# EAGLE schematic stm32f103c8t6 (EAGLE 9.6.2)
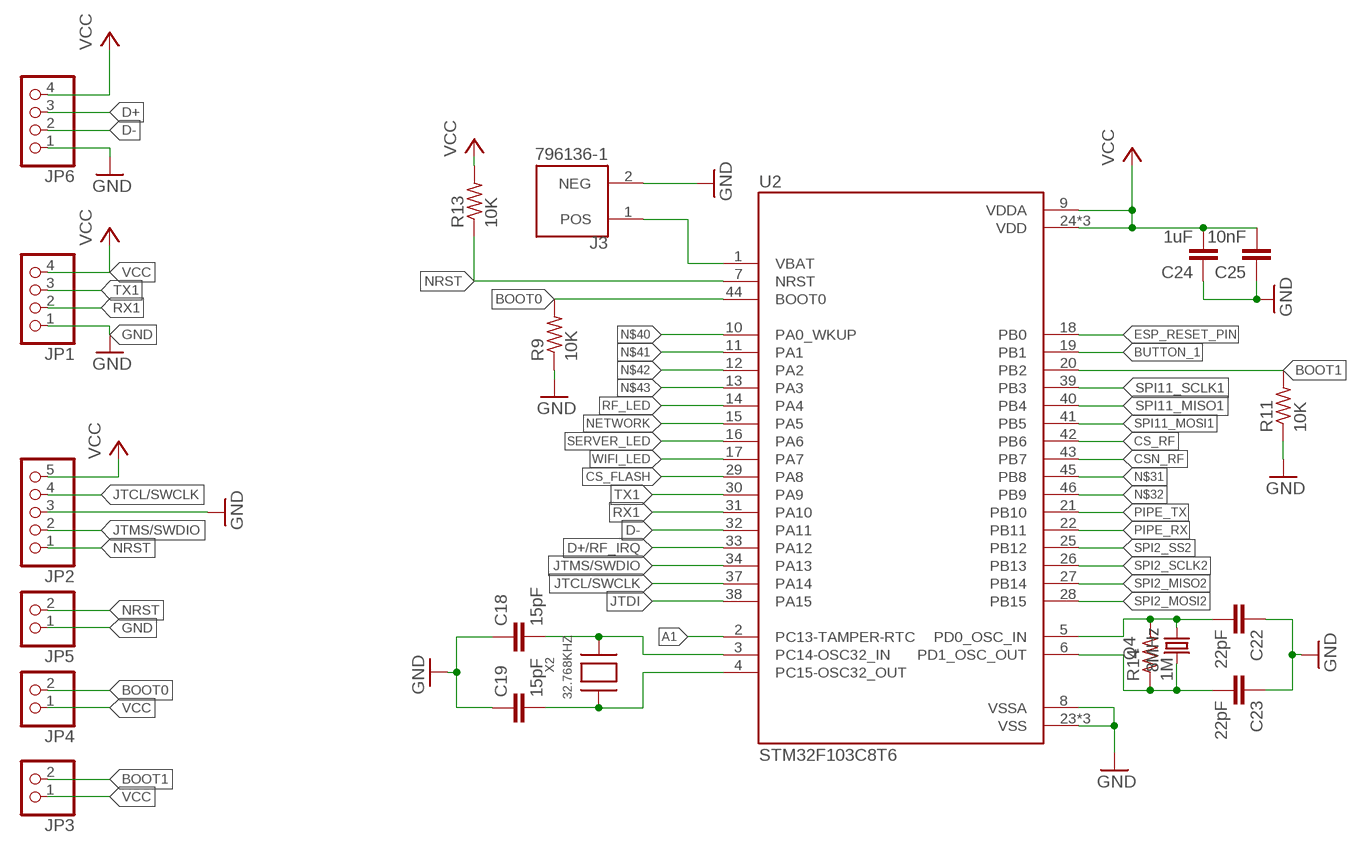
[diagram p0: schematic, sheet 1]

## Parts
C18  15pF  C-EUC0603  [C0603]
C19  15pF  C-EUC0603  [C0603]
C22  22pF  C-EUC0603  [C0603]
C23  22pF  C-EUC0603  [C0603]
C24  1uF  C-EUC0603  [C0603]
C25  10nF  C-EUC0603  [C0603]
J3  796136-1  [TE_796136-1]
JP1  PINHD-1X4  [1X04]
JP2  PINHD-1X5  [1X05]
JP3  PINHD-1X2  [1X02]
JP4  PINHD-1X2  [1X02]
JP5  PINHD-1X2  [1X02]
JP6  PINHD-1X4  [1X04]
Q4  8MHz  KX-7  [3.2X2.5_KX-7]
R9  10K  R-US_R0603  [R0603]
R11  10K  R-US_R0603  [R0603]
R13  10K  R-US_R0603  [R0603]
R14  1M  R-US_R0603  [R0603]
U2  STM32F103C8T6  [QFP50P900X900X160-48N]
X2  32.768KHZ  XTAL-3.2X1.5  [XTAL3215]

## Nets
A1: U2.2(PC13-TAMPER-RTC)
BOOT0: JP4.2 R9.2 U2.44(BOOT0)
BOOT1: JP3.2 R11.2 U2.20(PB2)
BUTTON_1: U2.19(PB1)
CS_FLASH: U2.29(PA8)
CS_RF: U2.42(PB6)
CSN_RF: U2.43(PB7)
D+: JP6.3
D+/RF_IRQ: U2.33(PA12)
D-: JP6.2 U2.32(PA11)
ESP_RESET_PIN: U2.18(PB0)
GND: C18.1 C19.1 C22.1 C23.1 C24.1 C25.1 J3.2(NEG) JP1.1 JP2.3 JP5.1 JP6.1 R9.1 R11.1 U2.8(VSSA) U2.23(VSS) U2.35(VSS) U2.47(VSS)
JTCL/SWCLK: JP2.4 U2.37(PA14)
JTDI: U2.38(PA15)
JTMS/SWDIO: JP2.2 U2.34(PA13)
N$9: C18.2 U2.3(PC14-OSC32_IN) X2.P$2
N$10: C19.2 U2.4(PC15-OSC32_OUT) X2.P$1
N$30: C23.2 Q4.3 R14.1 U2.6(PD1_OSC_OUT)
N$31: C22.2 Q4.1 R14.2 U2.5(PD0_OSC_IN) U2.45(PB8)
N$32: J3.1(POS) U2.1(VBAT) U2.46(PB9)
N$40: U2.10(PA0_WKUP)
N$41: U2.11(PA1)
N$42: U2.12(PA2)
N$43: U2.13(PA3)
NETWORK: U2.15(PA5)
NRST: JP2.1 JP5.2 R13.1 U2.7(NRST)
PIPE_RX: U2.22(PB11)
PIPE_TX: U2.21(PB10)
RF_LED: U2.14(PA4)
RX1: JP1.2 U2.31(PA10)
SERVER_LED: U2.16(PA6)
SPI2_MISO2: U2.27(PB14)
SPI2_MOSI2: U2.28(PB15)
SPI2_SCLK2: U2.26(PB13)
SPI2_SS2: U2.25(PB12)
SPI11_MISO1: U2.40(PB4)
SPI11_MOSI1: U2.41(PB5)
SPI11_SCLK1: U2.39(PB3)
TX1: JP1.3 U2.30(PA9)
VCC: C24.2 C25.2 JP1.4 JP2.5 JP3.1 JP4.1 JP6.4 R13.2 U2.9(VDDA) U2.24(VDD) U2.36(VDD) U2.48(VDD)
WIFI_LED: U2.17(PA7)

## Library data of the parts
C18 C19 C22-C25 = rcl:C-EU: CAPACITOR, European symbol; SPICEPREFIX: C
J3 = 796136-1:796136-1: BATTERY HOLDER COIN 20MM SMD Check prices <https://pricing.snapeda.com/parts/796136-1/TE%20Connectivity/view-part?ref=eda>; AVAILABILITY: Good; COMMENT: 796136-1; DESCRIPTION: BATTERY HOLDER; No. of Batteries:1; Terminal Type:Surface Mount; For Use With:CR2032 Batteries; Accessory Type:Battery Holder; Battery Size Code:2032; EU_ROHS_COMPLIANCE: Compliant; MF: TE Connectivity; MP: 796136-1; NUMBER_OF_POSITIONS: 2; PACKAGE: CR 2032 Battery Holder TE Connectivity; PRICE: None; PURCHASE-URL: https://pricing.snapeda.com/search/part/796136-1/?ref=eda
JP1 JP6 = pinhead:PINHD-1X4: PIN HEADER
JP2 = pinhead:PINHD-1X5: PIN HEADER
JP3-JP5 = pinhead:PINHD-1X2: PIN HEADER
Q4 = crystal-geyer_V1_0:KX: Quartz Crystals (MHz) SMD: KX - Serie Model Size l/w/h [mm] Frequency Range Frequency Stability Temp. Range [°C] Load Capacitance AECQ 200 availabel Datasheet KX-4 KX-5 KX-6 KX-7 KX-9A KX-9B KX-12A KX-12B KX-13 KX-20 KX-K KX-KS 1.6/1.2/0.3 2.0/1.6/0.45 2.5/2.0/0.55 3.2/2.5/0.8 5.0/3.2/1.0 5.0/3.2/1.1 6.0/3.5/1.1 6.0/3.5/1.0 7.0/5.0 /1.3 11.6/5.5/1.6 12.3/4.5/4.2 12.3/4.5/3.2 24.0 ~ 80.0 MHz 16.0 ~ 80.0 MHz 12.0 ~ 80.0 MHz 8.0 ~ 60.0 MHz 7,68 ~ 300,0 MHz 8,0 ~ 50,0 MHz 8,0 ~ 150,0 MHz 8,0 ~ 50,0 MHz 6,0 ~ 160,0 MHz 3,579 ~ 25,0 MHz 3,579 ~ 70,0 MHz 3,579 ~ 70,0 MHz ±10 … ±50ppm ±10 … ±50ppm ±10 … ±50ppm ±10 … ±50ppm ±10 … ±50ppm ±10 … ±50ppm ±10 … ±50ppm ±10 … ±50ppm ±10 … ±50ppm ±50ppm ±10 … ±50ppm ±10 … ±50ppm (*) -40°C …+85°C (*) -40°C …+125°C (*) -40°C …+125°C (*) -40°C …+125°C (*) -40°C …+105°C (*) -40°C …+105°C (*) -40°C …+125°C (*) -40°C …+105°C (*) -40°C …+105°C (*) -40°C …+105°C (*) -40°C …+85°C (*) -40°C …+85°C 8, 8…16 8, 8…16 10, 8…16 12, 7…20 16, 10…20 16, 10…20 16, 10…20 16, 12…20 16, 12…20 16, 12…20 16, 12…30 16, 12…30 - yes yes yes - - - - - - - - KX-4.pdf <http://www.geyer-electronic.de/uploads/tx_userartikelfrequenz/GEYER-KX-4.pdf> KX-5.pdf <http://www.geyer-electronic.de/uploads/tx_userartikelfrequenz/GEYER-KX-5.pdf> KX-6.pdf <http://www.geyer-electronic.de/uploads/tx_userartikelfrequenz/GEYER-KX-6.pdf> KX-7.pdf <http://www.geyer-electronic.de/uploads/tx_userartikelfrequenz/GEYER-KX-7.pdf> KX-9A.pdf <http://www.geyer-electronic.de/uploads/tx_userartikelfrequenz/GEYER-KX-9A.pdf> KX-9B.pdf <http://www.geyer-electronic.de/uploads/tx_userartikelfrequenz/GEYER-KX-9B.pdf> KX-12A.pdf <http://www.geyer-electronic.de/uploads/tx_userartikelfrequenz/GEYER-KX-12A.pdf> KX-12B.pdf <http://www.geyer-electronic.de/uploads/tx_userartikelfrequenz/GEYER-KX-12B.pdf> KX-13.pdf <http://www.geyer-electronic.de/uploads/tx_userartikelfrequenz/GEYER-KX-13.pdf> KX-20.pdf <http://www.geyer-electronic.de/uploads/tx_userartikelfrequenz/GEYER-KX-20.pdf> KX-K.pdf <http://www.geyer-electronic.de/uploads/tx_userartikelfrequenz/GEYER-KX-K.pdf> KX-KS.pdf <http://www.geyer-electronic.de/uploads/tx_userartikelfrequenz/GEYER-KX-KS.pdf> <http://www.geyer-electronic.de/fileadmin/template/img/logo-geyer-electronic.png> Details see: http://www.geyer-electronic.de/Frequenz-Produkte.9.0.html Created 2016-06-07, Hans Locher 2016 (C) Geyer Quartz Technology KX4,KX5,KX6,KX7,KX9A,KX9B,KX12A,KX12B,KX13,KX20,KXK,KXKS;1612;2016;2520;3225;5032;6035;7050;11655;12345;1,6x1,2;2,0x1,6;2,5x2,0;3,2x2,5;5,0x3,2;6,0x3,5;7,0x5,0;11,6x5,5;12,3x4,5;12,3x4,5;1.6x1.2;2.0x1.6;2.5x2.0;3.2x2.5;5.0x3.2;6.0x3.5;7.0x5.0;11.6x5.5;12.3x4.5;12.3x4.5;
R9 R11 R13 R14 = rcl:R-US_: RESISTOR, American symbol; SPICEPREFIX: R
U2 = STM32F103C8T6:STM32F103C8T6: Mainstream Performance line, ARM Cortex-M3 MCU with 64 Kbytes Flash, 72 MHz CPU, motor control, USB and CAN Check prices <https://pricing.snapeda.com/parts/STM32F103C8T6/STMicroelectronics/view-part?ref=eda>; AVAILABILITY: Warning; DESCRIPTION: ARM® Cortex®-M3 STM32F1 Microcontroller IC 32-Bit 72MHz 64KB (64K x 8) FLASH 48-LQFP (7x7); MF: STMicroelectronics; MP: STM32F103C8T6; PACKAGE: LQFP-48 STMicroelectronics; PRICE: None; PURCHASE-URL: https://pricing.snapeda.com/search/part/STM32F103C8T6/?ref=eda
X2 = adafruit:XTAL: Low cost SMT crystals, no capacitors included http://www.ladyada.net/library/eagle